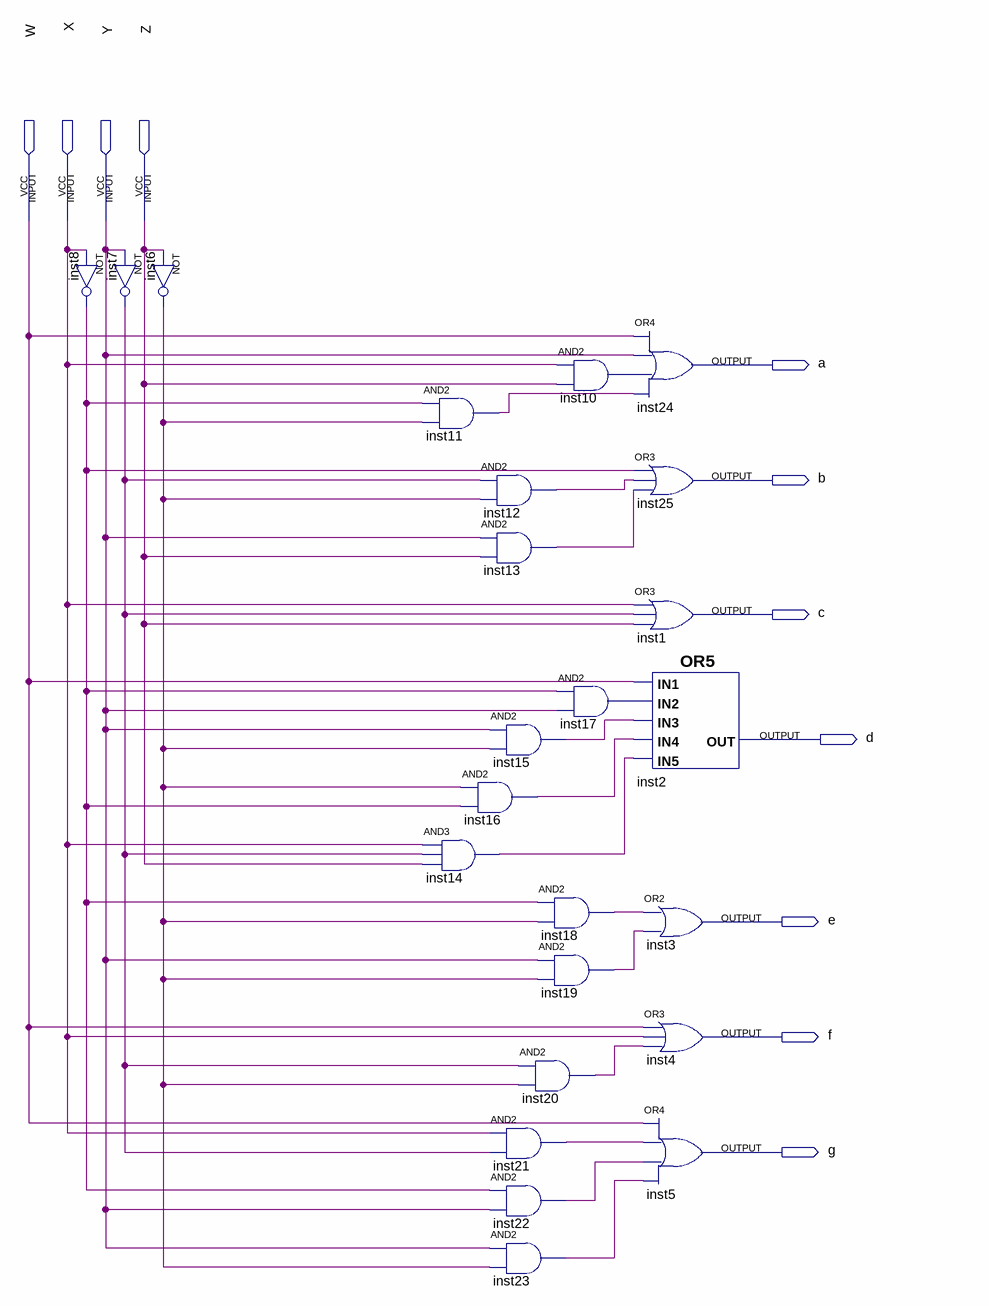
[diagram p0: schematic sheet]
// Quartus schematic sevenlevel.bdf as structural Verilog: 24 symbols, 11 pins
module sevenlevel (
  input  W,
  input  X,
  input  Y,
  input  Z,
  output a,
  output b,
  output c,
  output d,
  output e,
  output f,
  output g
);

  wire inst6_out, inst7_out, inst8_out, inst10_out, inst11_out, inst12_out, inst13_out, inst14_out,
       inst15_out, inst16_out, inst17_out, inst18_out, inst19_out, inst20_out, inst21_out, inst22_out,
       inst23_out;

  not inst8 (inst8_out, X);
  not inst6 (inst6_out, Z);
  not inst7 (inst7_out, Y);
  and inst11 (inst11_out, inst8_out, inst6_out);
  and inst14 (inst14_out, X, inst7_out, Z);
  and inst12 (inst12_out, inst7_out, inst6_out);
  and inst13 (inst13_out, Y, Z);
  and inst15 (inst15_out, Y, inst6_out);
  and inst16 (inst16_out, inst6_out, inst8_out);
  and inst20 (inst20_out, inst7_out, inst6_out);
  and inst21 (inst21_out, X, inst7_out);
  and inst22 (inst22_out, inst8_out, Y);
  and inst23 (inst23_out, Y, inst6_out);
  and inst10 (inst10_out, X, Z);
  and inst17 (inst17_out, inst8_out, Y);
  and inst18 (inst18_out, inst8_out, inst6_out);
  and inst19 (inst19_out, Y, inst6_out);
  or inst24 (a, W, Y, inst10_out, inst11_out);
  or inst25 (b, inst8_out, inst12_out, inst13_out);
  or inst1 (c, X, inst7_out, Z);
  or inst2 (d, W, inst17_out, inst15_out, inst16_out, inst14_out);
  or inst3 (e, inst18_out, inst19_out);
  or inst4 (f, W, X, inst20_out);
  or inst5 (g, W, inst21_out, inst22_out, inst23_out);
endmodule
